# EAGLE design Acc_v0.1 (EAGLE 7.4.0)
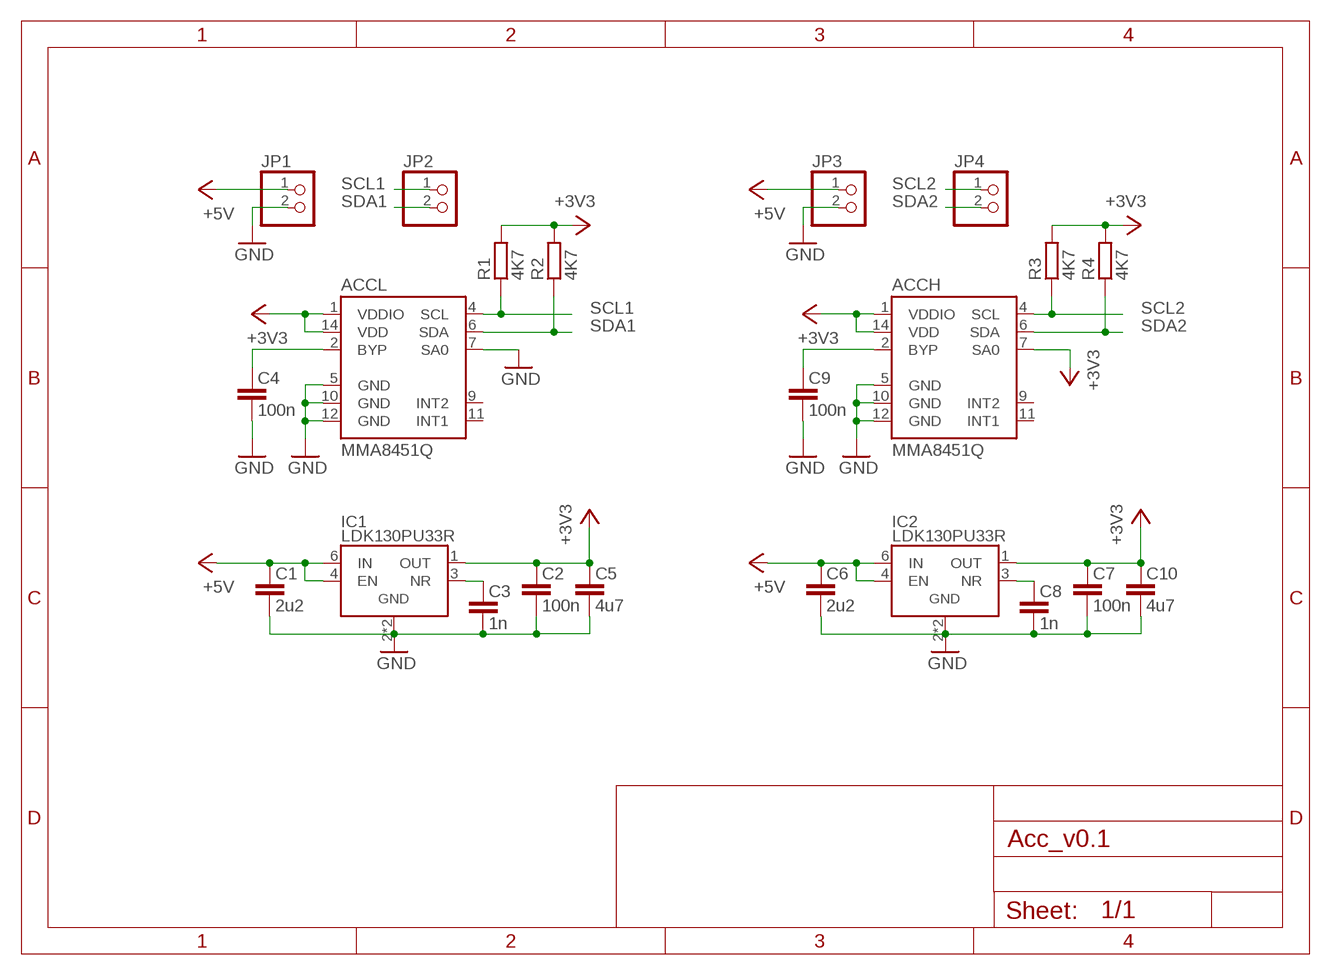
[diagram p0: schematic, sheet 1]

## Parts
ACCH  MMA8451Q  [QFN-16]
ACCL  MMA8451Q  [QFN-16]
C1  2u2  C_EU_C0603G  [C0603G]
C2  100n  C_EU_C0603G  [C0603G]
C3  1n  C_EU_C0603G  [C0603G]
C4  100n  C_EU_C0603G  [C0603G]
C5  4u7  C_EU_C0603G  [C0603G]
C6  2u2  C_EU_C0603G  [C0603G]
C7  100n  C_EU_C0603G  [C0603G]
C8  1n  C_EU_C0603G  [C0603G]
C9  100n  C_EU_C0603G  [C0603G]
C10  4u7  C_EU_C0603G  [C0603G]
IC1  LDK130PU33R  [DFN6L]
IC2  LDK130PU33R  [DFN6L]
JP1  PINHD-1X2/SMD  [1X02S]
JP2  PINHD-1X2/SMD  [1X02S]
JP3  PINHD-1X2/SMD  [1X02S]
JP4  PINHD-1X2/SMD  [1X02S]
R1  4K7  R_EU_R0603  [R0603]
R2  4K7  R_EU_R0603  [R0603]
R3  4K7  R_EU_R0603  [R0603]
R4  4K7  R_EU_R0603  [R0603]

## Nets
+3V3: ACCH.1(VDDIO) ACCH.7(SA0) ACCH.14(VDD) ACCL.1(VDDIO) ACCL.14(VDD) C2.1 C5.1 C7.1 C10.1 IC1.1(OUT) IC2.1(OUT) R1.2 R2.2 R3.2 R4.2
+5V: C1.1 C6.1 IC1.4(EN) IC1.6(IN) IC2.4(EN) IC2.6(IN) JP1.1 JP3.1
GND: ACCH.5(GND) ACCH.10(GND) ACCH.12(GND) ACCL.5(GND) ACCL.7(SA0) ACCL.10(GND) ACCL.12(GND) C1.2 C2.2 C3.2 C4.2 C5.2 C6.2 C7.2 C8.2 C9.2 C10.2 IC1.2(GND) IC1.5(GND) IC2.2(GND) IC2.5(GND) JP1.2 JP3.2
N$1: C8.1 IC2.3(NR)
N$2: ACCH.2(BYP) C9.1
N$3: C3.1 IC1.3(NR)
N$5: ACCL.2(BYP) C4.1
SCL1: ACCL.4(SCL) JP2.1 R1.1
SCL2: ACCH.4(SCL) JP4.1 R3.1
SDA1: ACCL.6(SDA) JP2.2 R2.1
SDA2: ACCH.6(SDA) JP4.2 R4.1
Unconnected: ACCH.9(INT2) ACCH.11(INT1) ACCL.9(INT2) ACCL.11(INT1)

## Library data of the parts
ACCH ACCL = SmartMDCPrint:MMA845
C1-C10 = SmartMDCPrint:C_EU_
IC1 IC2 = SmartMDCPrint:LDK130: LDK130 300 mA low quiescent current very low noise LDO
JP1-JP4 = SmartMDCPrint:PINHD-1X2: PIN HEADER
R1-R4 = SmartMDCPrint:R_EU_

## Board
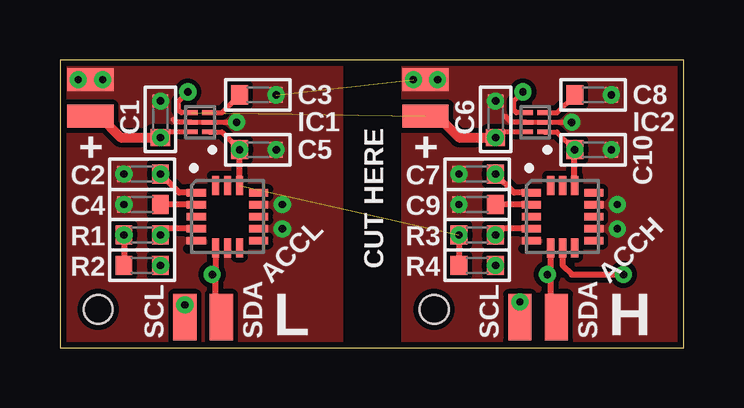
[diagram p1: board, top side]
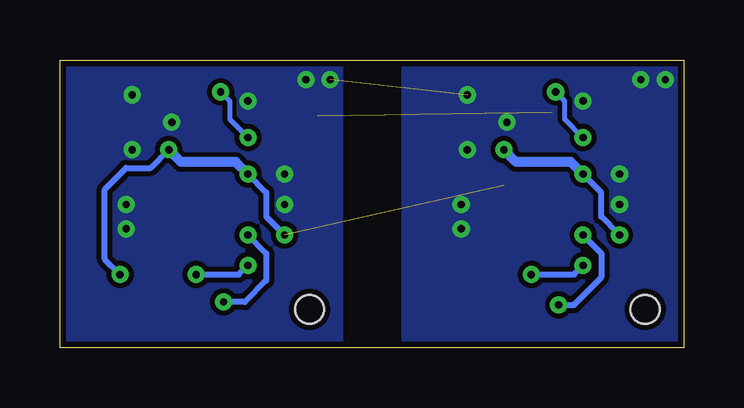
[diagram p2: board, bottom side, seen from below]

Size 26 x 12 mm. Coordinates in mm from the lower left corner, seen from the top.
Outline: 0,0 26,0 26,12 0,12 0,0
Copper layers (1*16): Top 0.035mm / dielectric 1.5mm / Bottom 0.035mm
Design rules "default *": minimum track width 6mil, minimum drill 12mil, track to track 7mil, track to pad 7mil, pad to pad 7mil, via to via 7mil, smd to smd 0mil, copper to edge 10mil, drill to drill 8mil, minimum pad ring 10mil, minimum via ring 8mil, stop-mask expansion 4mil, vias tented up to drill 12mil, thermal gap 10mil
Holes 1.2 mm at 1.6,1.6 15.6,1.6
tRestrict: 3 lines
bRestrict: 1 lines

### Footprints (pad centres in the part's own frame; a part is rotated, then mirrored left to right if it is on the bottom)
QFN-16 = smd 0.8 x 0.3: 1 -1.3,1; 2 -1.3,0.5; 3 -1.3,0; 4 -1.3,-0.5; 5 -1.3,-1; 9 1.3,-1; 10 1.3,-0.5; 11 1.3,0; 12 1.3,0.5; 13 1.3,1 | smd 0.3 x 0.8: 6 -0.5,-1.3; 7 0,-1.3; 8 0.5,-1.3; 14 0.5,1.3; 15 0,1.3; 16 -0.5,1.3
C0603G = smd 0.7 x 0.8: 1 -0.762,0 | smd 0.548 x 0.648: 2 0.762,0
DFN6L = smd 0.203 x 0.533: 1 -0.4,-0.36; 2 0,-0.36; 3 0.4,-0.36; 4 0.4,0.36; 5 0,0.36; 6 -0.4,0.36
1X02S = smd 0.965 x 1.93: 1 -0.762,0; 2 0.762,0
R0603 = smd 0.7 x 0.8: 1 -0.762,0; 2 0.762,0

### Placement (x,y rotation side)
ACCH  20.95,5.46 0 top
ACCL  6.99,5.46 0 top
C1  4.19,9.53 90 top
C2  3.43,7.24 180 top
C3  8.26,10.54 0 top
C4  3.43,5.97 180 top
C5  8.26,8.26 0 top
C6  18.16,9.53 90 top
C7  17.4,7.24 180 top
C8  22.23,10.54 0 top
C9  17.4,5.97 180 top
C10  22.23,8.26 0 top
IC1  5.84,9.4 90 top
IC2  19.81,9.4 90 top
JP1  1.27,10.41 90 top
JP2  5.97,1.27 0 top
JP3  15.24,10.41 90 top
JP4  19.94,1.27 0 top
R1  3.43,4.7 180 top
R2  3.43,3.43 180 top
R3  17.4,4.7 180 top
R4  17.4,3.43 180 top

### Tracks (layer width: path | path; a pad name or v marks a point on that pad's centre or on a via)
+3V3  (via drill 0.3)  (1 unrouted)
  Top 0.203: IC1.1 6.75,9 C5.1 | IC2.1 20.72,9 C10.1
  Top 0.254: ACCL.14 7.49,8.25 C5.1 | ACCH.14 21.45,8.25 C10.1 | R1.2 R2.2 | R3.2 R4.2 | ACCL.1 4.97,6.46 C2.1 | ACCH.7 20.95,3.43 21.34,3.05 v23.5,3.05 | ACCH.1 18.94,6.46 C7.1
  Bottom 0.254: R1.2 3.43,5.46 3.43,6.48 C2.1 | C7.1 17.4,6.48 17.4,5.46 R3.2 | v23.5,3.05 24.13,3.68 24.13,6.6 23.24,7.49 22.23,7.49 C10.1
  Bottom 0.406: C10.1 20.95,7.75 18.67,7.75 C7.1 | C2.1 4.7,7.75 6.99,7.75 C5.1
  other vias: 21.46,8.26 18.16,7.24 7.49,8.26 4.19,7.24 2.67,4.7 16.64,4.7
+5V  (via drill 0.3)  (1 unrouted)
  Top 0.203: IC1.6 4.43,9 C1.1 | IC2.6 18.4,9 C6.1 | IC1.4 5.06,9.8 4.95,9.91 4.95,10.29 v5.33,10.67 | IC2.4 19.03,9.8 18.92,9.91 18.92,10.29 v19.3,10.67
  Top 0.406: JP1.1 1.65,9.65 2.54,8.76 C1.1 | JP3.1 15.49,9.91 16.64,8.76 C6.1
  Bottom 0.203: C1.1 4.95,9.53 4.95,10.29 v5.33,10.67 | v19.3,10.67 18.92,10.29 18.92,9.53 C6.1
  other vias: 4.19,8.76 18.16,8.76
GND  (via drill 0.3)  (1 unrouted)
  Top 0.203: v7.37,9.4 IC1.2 IC1.5 4.83,9.4 4.7,9.53 | 18.54,9.65 18.8,9.4 IC2.5 IC2.2 21.21,9.4
  other vias: 9.02,8.26 2.67,5.97 2.67,7.24 9.02,10.54 4.19,10.29 16.64,5.97 22.99,8.26 16.64,7.24 22.99,10.54 18.16,10.29 9.27,5.97 9.27,4.95 23.24,5.97 23.24,4.95 21.34,9.4 0.76,11.18 15.75,11.18 1.78,11.18 14.73,11.18
  pour Top (isolate 0.203, rank 6, no thermals): 0,0 0,12 26,12 26,0
  pour Bottom (isolate 0.203, rank 6, no thermals): 0,0 0,12 26,12 26,0
N$1
  Top 0.203: IC2.3 20.72,9.8 C8.1
N$2
  Top 0.254: ACCH.2 C9.1
N$3
  Top 0.203: IC1.3 6.75,9.8 C3.1
N$5
  Top 0.254: ACCL.2 C4.1
SCL1  (via drill 0.3)
  Top 0.254: ACCL.4 4.45,4.96 R1.1 | JP2.1 v5.21,1.78
  Bottom 0.254: R1.1 3.43,3.94 3.43,2.92 4.57,1.78 v5.21,1.78
  other vias: 4.19,4.7
SCL2  (via drill 0.3)
  Top 0.254: ACCH.4 18.42,4.96 R3.1 | JP4.1 v19.18,1.91
  Bottom 0.254: R3.1 17.4,3.94 17.4,2.79 18.29,1.91 v19.18,1.91
  other vias: 18.16,4.7
SDA1  (via drill 0.3)
  Top 0.254: ACCL.6 6.49,3.18 v6.35,3.05 6.48,2.92 6.48,1.52 JP2.2
  Bottom 0.254: v6.35,3.05 4.57,3.05 R2.1
  other vias: 4.19,3.43
SDA2  (via drill 0.3)
  Top 0.254: ACCH.6 20.45,3.18 v20.32,3.05 20.45,2.92 20.45,1.52 JP4.2
  Bottom 0.254: v20.32,3.05 18.54,3.05 R4.1
  other vias: 18.16,3.43

### Text on the board
tPlace: + | + | CUT HERE | L | H | SCL | SDA | SCL | SDA